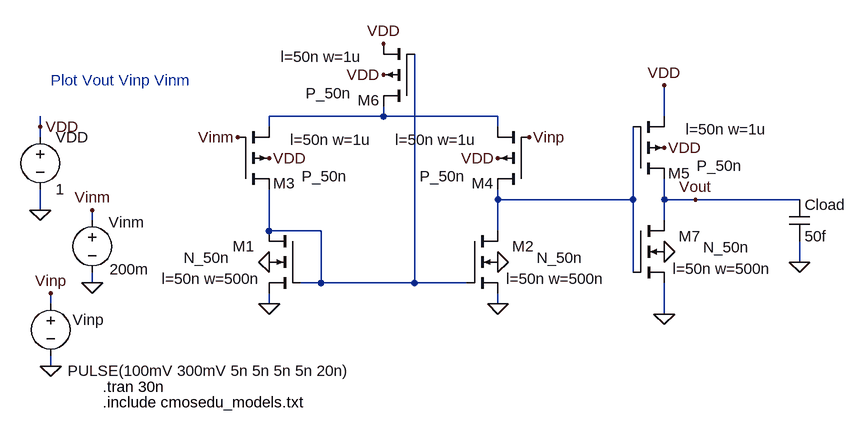
[diagram p0: schematic Fig18_22.asc]
Fig18_22.asc, the LTspice schematic file:
Version 4
SHEET 1 1496 680
WIRE 752 -560 752 -576
WIRE 752 -560 576 -560
WIRE 928 -560 752 -560
WIRE 1184 -560 1184 -608
WIRE 224 -544 224 -560
WIRE 576 -544 576 -560
WIRE 928 -544 928 -560
WIRE 224 -528 224 -544
WIRE 928 -432 928 -448
WIRE 1136 -432 1136 -544
WIRE 1136 -432 928 -432
WIRE 1184 -432 1184 -464
WIRE 1232 -432 1184 -432
WIRE 1392 -432 1232 -432
WIRE 224 -416 224 -448
WIRE 304 -400 304 -416
WIRE 1184 -400 1184 -432
WIRE 576 -384 576 -448
WIRE 656 -384 576 -384
WIRE 928 -384 928 -432
WIRE 1392 -336 1392 -368
WIRE 1136 -320 1136 -432
WIRE 304 -304 304 -320
WIRE 656 -304 656 -384
WIRE 656 -304 624 -304
WIRE 800 -304 800 -656
WIRE 800 -304 656 -304
WIRE 880 -304 800 -304
WIRE 240 -272 240 -288
WIRE 576 -272 576 -288
WIRE 928 -272 928 -288
WIRE 1184 -256 1184 -304
WIRE 240 -176 240 -192
FLAG 240 -176 0
FLAG 240 -288 Vinp
FLAG 576 -336 0
FLAG 224 -416 0
FLAG 224 -544 VDD
FLAG 576 -496 VDD
FLAG 928 -496 VDD
FLAG 928 -336 0
FLAG 304 -304 0
FLAG 304 -416 Vinm
FLAG 1184 -512 VDD
FLAG 1184 -608 VDD
FLAG 1184 -352 0
FLAG 1184 -256 0
FLAG 1232 -432 Vout
FLAG 1392 -336 0
FLAG 752 -624 VDD
FLAG 752 -672 VDD
FLAG 576 -272 0
FLAG 928 -272 0
FLAG 528 -528 Vinm
FLAG 976 -528 Vinp
SYMBOL nmos4 624 -384 M0
WINDOW 0 104 24 Right 2
WINDOW 3 179 41 Right 2
WINDOW 123 213 74 Right 2
SYMATTR InstName M1
SYMATTR Value N_50n
SYMATTR Value2 l=50n w=500n
SYMBOL voltage 240 -288 R0
WINDOW 0 34 41 Left 2
WINDOW 3 26 119 Left 2
WINDOW 123 0 0 Left 2
WINDOW 39 0 0 Left 2
SYMATTR InstName Vinp
SYMATTR Value PULSE(100mV 300mV 5n 5n 5n 5n 20n)
SYMBOL voltage 224 -544 R0
WINDOW 123 0 0 Left 2
WINDOW 39 0 0 Left 2
SYMATTR InstName VDD
SYMATTR Value 1
SYMBOL pmos4 528 -448 M180
WINDOW 0 88 9 Right 2
WINDOW 3 168 20 Right 2
WINDOW 123 206 76 Right 2
SYMATTR InstName M3
SYMATTR Value P_50n
SYMATTR Value2 l=50n w=1u
SYMBOL pmos4 976 -448 R180
WINDOW 0 88 9 Right 2
WINDOW 3 168 20 Right 2
WINDOW 123 206 76 Right 2
SYMATTR InstName M4
SYMATTR Value P_50n
SYMATTR Value2 l=50n w=1u
SYMBOL nmos4 880 -384 R0
WINDOW 0 104 24 Right 2
WINDOW 3 179 41 Right 2
WINDOW 123 213 74 Right 2
SYMATTR InstName M2
SYMATTR Value N_50n
SYMATTR Value2 l=50n w=500n
SYMBOL voltage 304 -416 R0
WINDOW 0 25 19 Left 2
WINDOW 3 27 91 Left 2
WINDOW 123 0 0 Left 2
WINDOW 39 0 0 Left 2
SYMATTR InstName Vinm
SYMATTR Value 200m
SYMBOL pmos4 1136 -464 M180
WINDOW 0 88 9 Right 2
WINDOW 3 168 20 Right 2
WINDOW 123 206 76 Right 2
SYMATTR InstName M5
SYMATTR Value P_50n
SYMATTR Value2 l=50n w=1u
SYMBOL nmos4 1136 -400 R0
WINDOW 0 104 24 Right 2
WINDOW 3 179 41 Right 2
WINDOW 123 213 74 Right 2
SYMATTR InstName M7
SYMATTR Value N_50n
SYMATTR Value2 l=50n w=500n
SYMBOL cap 1376 -432 R0
SYMATTR InstName Cload
SYMATTR Value 50f
SYMBOL pmos4 800 -576 R180
WINDOW 0 88 9 Right 2
WINDOW 3 168 20 Right 2
WINDOW 123 206 76 Right 2
SYMATTR InstName M6
SYMATTR Value P_50n
SYMATTR Value2 l=50n w=1u
TEXT 320 -144 Left 2 !.tran 30n
TEXT 320 -120 Left 2 !.include cmosedu_models.txt
TEXT 240 -616 Left 2 ;Plot Vout Vinp Vinm

The netlist it stands for:
* Fig18_22.asc
M1 N003 N003 0 0 N_50n l=50n w=500n
Vinp Vinp 0 PULSE(100mV 300mV 5n 5n 5n 5n 20n)
VDD VDD 0 1
M3 N003 Vinm N001 VDD P_50n l=50n w=1u
M4 N002 Vinp N001 VDD P_50n l=50n w=1u
M2 N002 N003 0 0 N_50n l=50n w=500n
Vinm Vinm 0 200m
M5 Vout N002 VDD VDD P_50n l=50n w=1u
M7 Vout N002 0 0 N_50n l=50n w=500n
Cload Vout 0 50f
M6 N001 N003 VDD VDD P_50n l=50n w=1u
.model NMOS NMOS
.model PMOS PMOS
.lib standard.mos
.tran 30n
.include cmosedu_models.txt
* Plot Vout Vinp Vinm
.backanno
.end